# EAGLE design lidar2 (EAGLE 9.0.1)
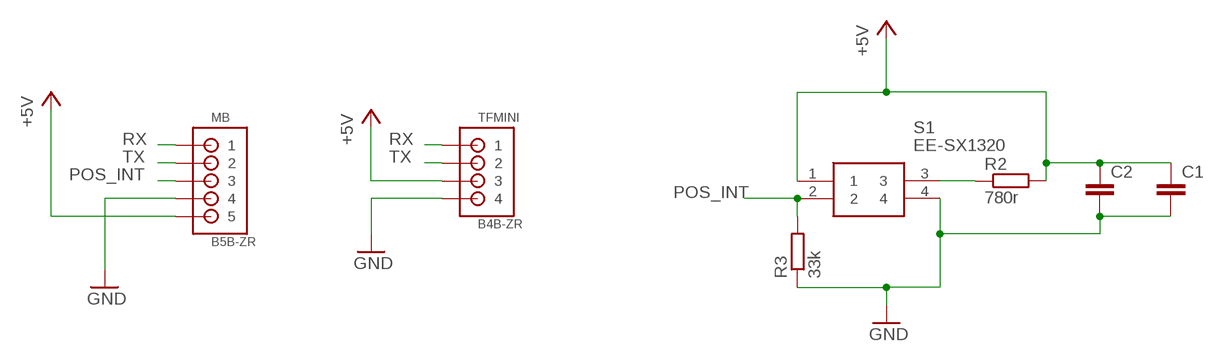
[diagram p0: schematic, sheet 1]

## Parts
C1  C-EUC1206  [C1206]
C2  C-EUC0805  [C0805]
MB  B5B-ZR  [B5B-ZR]
R2  780r  R-EU_R0603  [R0603]
R3  33k  R-EU_R0603  [R0603]
S1  EE-SX1320  [EE-SX1320]
TFMINI  B4B-ZR  [B4B-ZR]

## Nets
+5V: C1.1 C2.1 MB.5 R2.2 S1.1 TFMINI.3
GND: C1.2 C2.2 MB.4 R3.1 S1.4 TFMINI.4
N$1: R2.1 S1.3
POS_INT: MB.3 R3.2 S1.2
RX: MB.1 TFMINI.1
TX: MB.2 TFMINI.2

## Library data of the parts
C1 C2 = rcl:C-EU: CAPACITOR, European symbol; SPICEPREFIX: C
MB = jst:B5B-ZR: JST-ZH Connector 5 pol, 1.5mm pitch Package: B5B-ZR Source: http://www.jst-mfg.com/product/pdf/eng/eZH.pdf
R2 R3 = rcl:R-EU_: RESISTOR, European symbol; SPICEPREFIX: R
S1 = EE-SX1320:EE-SX1320: Optical Switches, Transmissive, Phototransistor Output SMT, 2mm Transmissive Photo Source: Datasheet <http://www.mouser.com/datasheet/2/307/en-ee_sx1320-1092605.pdf>; DESCRIPTION: Optical Switches, Transmissive, Phototransistor Output SMT, 2mm Transmissive Photo; HEIGHT: mm; MANUFACTURER_NAME: Omron Electronics; MANUFACTURER_PART_NUMBER: EE-SX1320; MOUSER_PART_NUMBER: 653-EESX1320
TFMINI = jst:B4B-ZR: JST-ZH Connector 4 pol, 1.5mm pitch Package: B4B-ZR Source: http://www.jst-mfg.com/product/pdf/eng/eZH.pdf

## Board
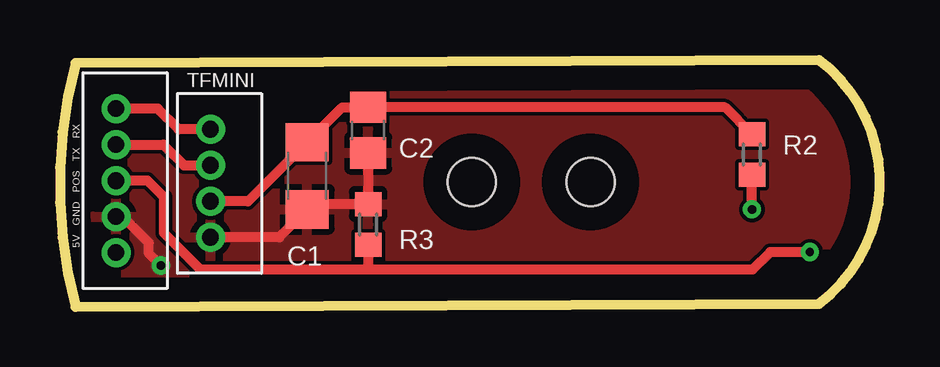
[diagram p1: board, top side]
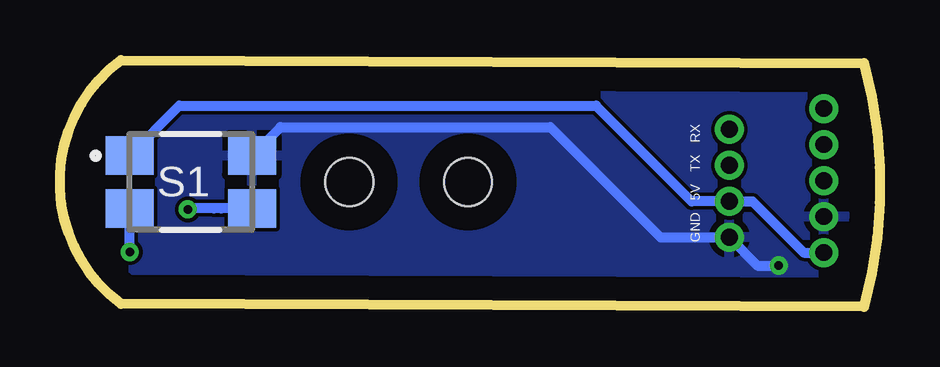
[diagram p2: board, bottom side, seen from below]

Size 34.18 x 10.29 mm. Coordinates in mm from the lower left corner, seen from the top.
Outline: 0.66,0 31.64,0.13 arc106 31.64,10.29 0.66,10.16 arc30 0.66,0
Copper layers (1*16): Top 0.035mm / dielectric 1.5mm / Bottom 0.035mm
Design rules "default": minimum track width 6mil, minimum drill 0.35mm, track to track 6mil, track to pad 6mil, pad to pad 6mil, via to via 6mil, smd to smd 6mil, copper to edge 40mil, drill to drill 6mil, minimum pad ring 10mil, minimum via ring 8mil, stop-mask expansion 4mil, vias tented up to drill 0mil, thermal gap 10mil
Holes 2 mm at 17.17,5.21 22.12,5.21

### Footprints (pad centres in the part's own frame; a part is rotated, then mirrored left to right if it is on the bottom)
C1206 = smd 1.6 x 1.8: 1 -1.4,0; 2 1.4,0
C0805 = smd 1.3 x 1.5: 1 -0.95,0; 2 0.95,0
B5B-ZR = drill 0.7: 1 7.5,-1.3; 2 6,-1.3; 3 4.5,-1.3; 4 3,-1.3; 5 1.5,-1.3
R0603 = smd 1 x 1.1: 1 -0.85,0; 2 0.85,0
EE-SX1320 = smd 2 x 1.6: 1 -2.55,1.1; 2 -2.55,-1.1; 3 2.55,-1.1; 4 2.55,1.1
B4B-ZR = drill 0.7: 1 6,-1.3; 2 4.5,-1.3; 3 3,-1.3; 4 1.5,-1.3

### Placement (x,y rotation side)
C1  10.31,5.46 270 top
C2  12.85,7.37 270 top
MB  1.04,0.76 90 top
R2  28.85,6.35 90 top
R3  12.85,3.43 270 top
S1  28.72,5.21 0 bottom
TFMINI  4.97,1.4 90 top

### Tracks (layer width: path | path; a pad name or v marks a point on that pad's centre or on a via)
+5V
  Top 0.406: TFMINI.3 7.84,4.4 C1.1 11.76,8.32 C2.1 27.73,8.32 R2.2
  Bottom 0.406: S1.1 29.2,8.38 11.83,8.38 7.85,4.4 TFMINI.3 5.31,4.4 3.17,2.26 MB.5
GND  (via drill 0.35)
  Top 0.406: C2.2 R3.1 10.53,4.28 C1.2 9.14,2.9 TFMINI.4 | v4.21,1.72 3.7,2.23 3.7,2.67 2.61,3.76 MB.4
  Bottom 0.406: v4.21,1.72 5.1,1.72 TFMINI.4 9.14,2.9 13.74,7.49 24.99,7.49 S1.4
  pour Top: -3.03,12.83 -3.03,-2.41 36.34,-2.41 36.34,12.83
  pour Bottom: -1.76,11.56 -1.76,-1.14 35.07,-1.14 35.07,11.56
N$1  (via drill 0.35)
  Top 0.406: v28.85,4.06 R2.1
  Bottom 0.406: S1.3 27.45,4.11 27.75,4.11 28.81,4.11 v28.85,4.06
POS_INT  (via drill 0.35)
  Top 0.406: 31.22,2.29 v31.26,2.29 29.61,2.29 28.87,1.55 12.85,1.55 | 12.85,1.55 5.86,1.55 4.34,3.07 4.34,4.57 3.65,5.26 MB.3 | R3.2 12.85,1.55
  Bottom 0.406: v31.26,2.29 S1.2
RX
  Top 0.406: TFMINI.1 4.94,7.4 4.08,8.26 MB.1
TX
  Top 0.406: MB.2 4.31,6.76 5.17,5.9 TFMINI.2

### Text on the board
tNames: 5V GND POS TX RX
bNames: GND 5V TX RX